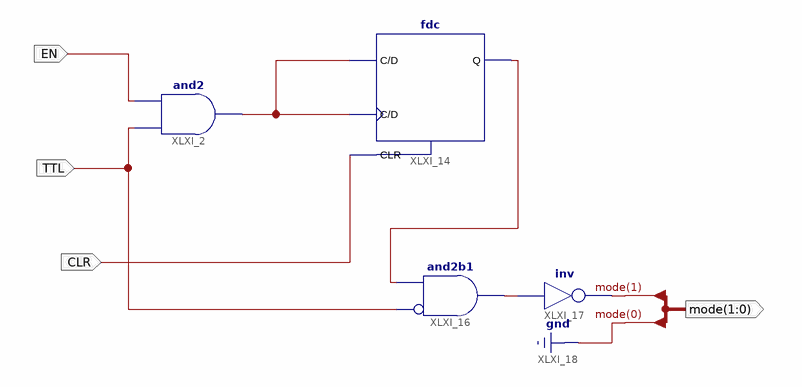
[diagram p0: schematic sheet 1]
// Xilinx ISE schematic UNLOCK.sch (spartan6) as structural Verilog: 4 symbols, 4 ports
module UNLOCK (
  input  EN,
  input  TTL,
  input  CLR,
  output [1:0] mode
);

  wire XLXN_20, XLXN_23, XLXN_31;

  and XLXI_2 (XLXN_20, TTL, EN);
  fdc XLXI_14 (.C(XLXN_20), .CLR(CLR), .D(XLXN_20), .Q(XLXN_23));
  and XLXI_16 (XLXN_31, ~TTL, XLXN_23);  // and2b1
  not XLXI_17 (mode[1], XLXN_31);

  assign mode[0] = 1'b0;
endmodule
